# Altium project Assem_Stn_2_Rev1.PrjPcb (part 3 of 3)
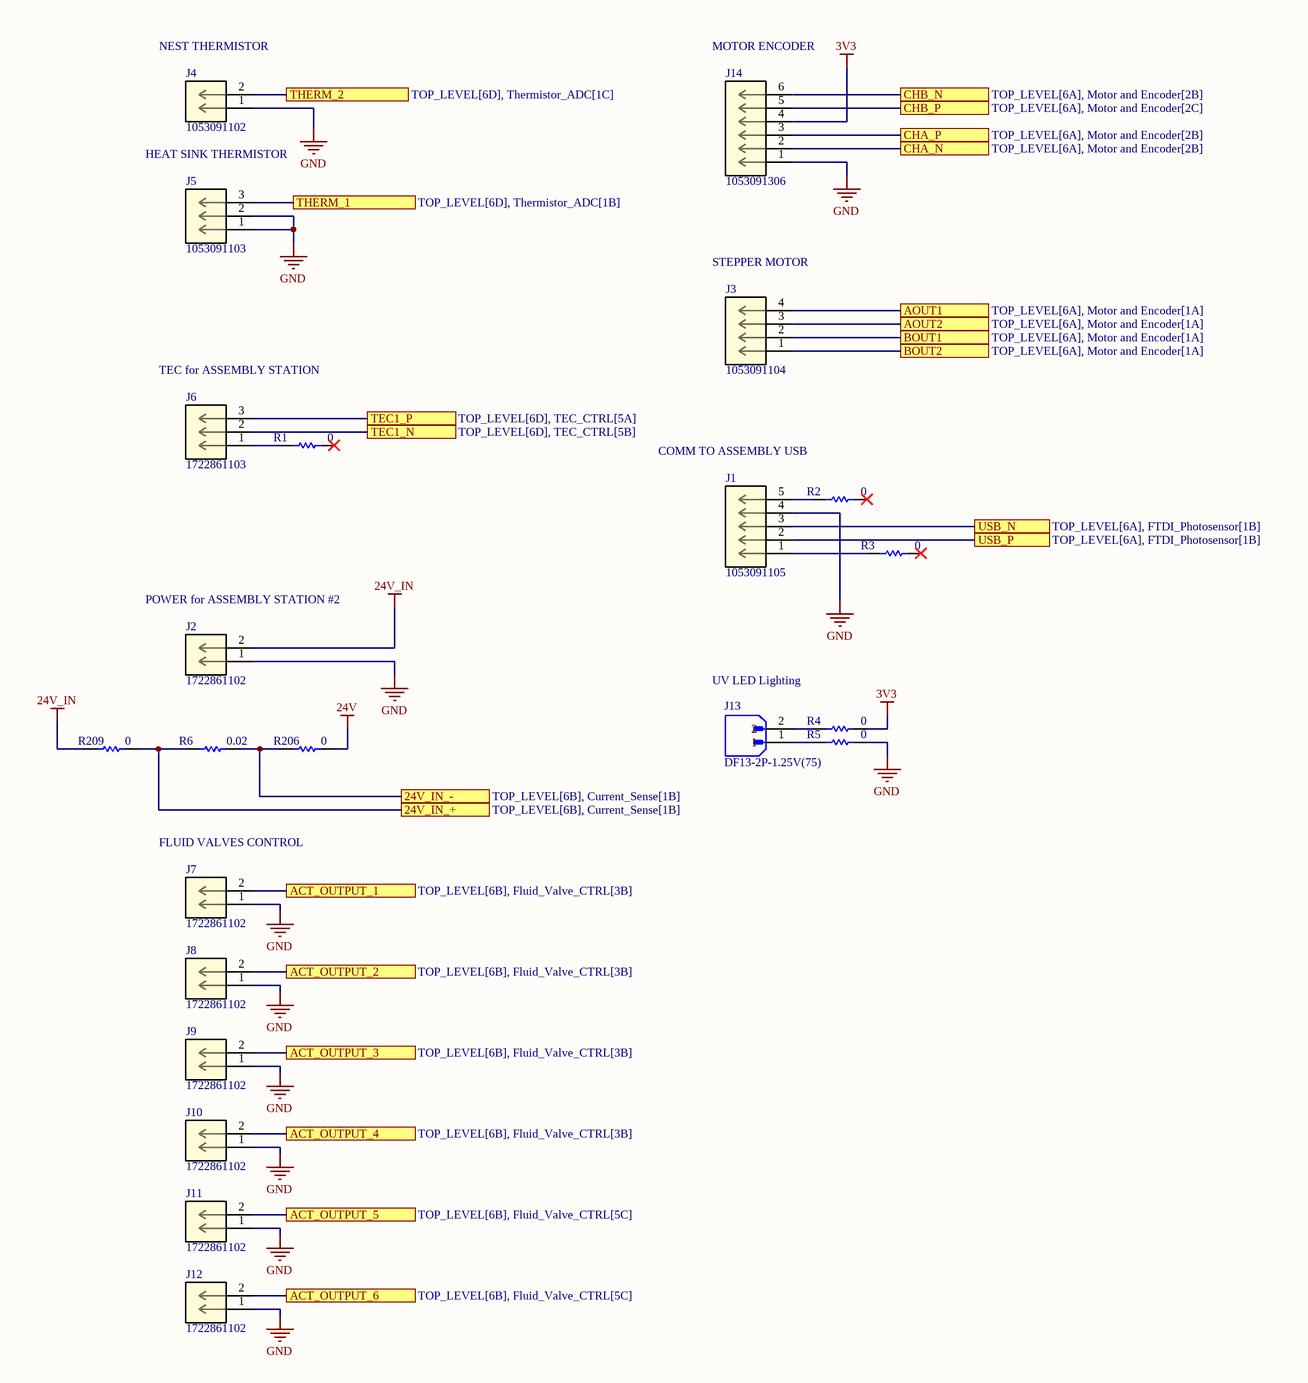
[diagram p11: Connectors.SchDoc]

## Nets that join several sheets
3V3: Motor and Encoder (C9.1 U3.1), Power_LoadSwitches (R49.1 R199.1 TP2.TP), TEC_CTRL (C40.2 C41.2 U7.12), Fluid_Valve_CTRL (6 pins), Thermistor_ADC (C64.2 C76.2 U11.10 U45.10), VREF_DAC (C88.2 U44.16), FTDI_Photosensor (R169.1 U20.1), MicroController (54 pins), Connectors (J14.4 R4.1)
5V: Motor and Encoder (C7.2 C8.2 U2.16 U3.14), Power_LoadSwitches (7 pins), TEC_CTRL (C38.2 C39.2 U7.14), Thermistor_ADC (6 pins), VREF_DAC (C87.2 C89.2 U44.7 U46.1), Current_Sense (12 pins), FTDI_Photosensor (C96.2 C97.2 U19.12)
24V: Power_LoadSwitches (16 pins), Connectors (R206.1)
24V_MOTOR: Motor and Encoder (7 pins), Power_LoadSwitches (5 pins)
24V_TEC: Power_LoadSwitches (5 pins), TEC_CTRL (17 pins)
24V_VALVES: Power_LoadSwitches (5 pins), Fluid_Valve_CTRL (12 pins)
GND: Motor and Encoder (15 pins), Power_LoadSwitches (46 pins), TEC_CTRL (22 pins), Fluid_Valve_CTRL (48 pins), Thermistor_ADC (27 pins), VREF_DAC (9 pins), Current_Sense (18 pins), FTDI_Photosensor (11 pins), MicroController (58 pins), Connectors (13 pins)
3V3_CURR_+: Power_LoadSwitches (5 pins), Current_Sense (R213.2)
3V3_CURR_-: Power_LoadSwitches (R48.1 R199.2), Current_Sense (R212.2)
3V3_CURR_INA181: Thermistor_ADC (R106.2), Current_Sense (U15.1)
5V_CURR_+: Power_LoadSwitches (7 pins), Current_Sense (R211.2)
5V_CURR_-: Power_LoadSwitches (R44.1 R203.2), Current_Sense (R210.2)
5V_CURR_INA181: Thermistor_ADC (R104.2), Current_Sense (U13.1)
24V_IN_+: Current_Sense (R146.2), Connectors (R6.2 R209.1)
24V_IN_-: Current_Sense (R145.2), Connectors (R6.1 R206.2)
24V_MOTOR_CURR_REG: Power_LoadSwitches (R62.1 U5.5), Thermistor_ADC (R116.2)
24V_MOTOR_EN: Power_LoadSwitches (R57.2), MicroController (U21.149)
24V_MTR_CURR+: Power_LoadSwitches (R56.2 U5.1 U5.7), Current_Sense (R217.2)
24V_MTR_CURR-: Power_LoadSwitches (R56.1 R201.2), Current_Sense (R216.2)
24V_TEC_CURR_+: Power_LoadSwitches (R50.2 U33.1 U33.7), Current_Sense (R142.2)
24V_TEC_CURR_-: Power_LoadSwitches (R50.1 R200.2), Current_Sense (R141.2)
24V_TEC_CURR_REG: Power_LoadSwitches (R54.1 U33.5), Thermistor_ADC (R113.2)
24V_TEC_EN: Power_LoadSwitches (R51.2), MicroController (U21.147)
24V_VALVE_EN: Power_LoadSwitches (R59.2), MicroController (U21.148)
24V_VALVES_CURR+: Power_LoadSwitches (R58.2 U6.1 U6.7), Current_Sense (R215.2)
24V_VALVES_CURR-: Power_LoadSwitches (R58.1 R202.2), Current_Sense (R214.2)
24V_VALVES_CURR_REG: Power_LoadSwitches (R66.1 U6.5), Thermistor_ADC (R115.2)
ACT_INPUT_1: Fluid_Valve_CTRL (R89.1 U8.30), MicroController (R180.1)
ACT_INPUT_2: Fluid_Valve_CTRL (R90.1 U8.11), MicroController (R181.1)
ACT_INPUT_3: Fluid_Valve_CTRL (R91.1 U8.15), MicroController (R183.1)
ACT_INPUT_4: Fluid_Valve_CTRL (R92.1 U8.26), MicroController (R186.1)
ACT_INPUT_5: Fluid_Valve_CTRL (R94.1 U9.30), MicroController (R187.1)
ACT_INPUT_6: Fluid_Valve_CTRL (R95.1 U9.11), MicroController (R188.1)
ACT_INPUT_7: Fluid_Valve_CTRL (R96.1 U9.15), MicroController (R189.1)
ACT_INPUT_8: Fluid_Valve_CTRL (R97.1 U9.26), MicroController (R190.1)
ACT_INPUT_EN: Fluid_Valve_CTRL (R86.2 R87.2), MicroController (U21.69)
ACT_OUTPUT_1: Fluid_Valve_CTRL (U8.31), Connectors (J7.2)
ACT_OUTPUT_2: Fluid_Valve_CTRL (U8.10), Connectors (J8.2)
ACT_OUTPUT_3: Fluid_Valve_CTRL (U8.16), Connectors (J9.2)
ACT_OUTPUT_4: Fluid_Valve_CTRL (U8.25), Connectors (J10.2)
ACT_OUTPUT_5: Fluid_Valve_CTRL (U9.31), Connectors (J11.2)
ACT_OUTPUT_6: Fluid_Valve_CTRL (U9.10), Connectors (J12.2)
AOUT1: Motor and Encoder (U1.5), Connectors (J3.4)
AOUT2: Motor and Encoder (U1.7), Connectors (J3.3)
BOUT1: Motor and Encoder (U1.10), Connectors (J3.2)
BOUT2: Motor and Encoder (U1.8), Connectors (J3.1)
CH_A_3V3: Motor and Encoder (R36.2), MicroController (U21.41)
CH_B_3V3: Motor and Encoder (R37.2), MicroController (U21.42)
CHA_N: Motor and Encoder (R20.2 R23.1), Connectors (J14.2)
CHA_P: Motor and Encoder (R21.2 R23.2), Connectors (J14.3)
CHB_N: Motor and Encoder (R32.2 R35.1), Connectors (J14.6)
CHB_P: Motor and Encoder (R30.2 R35.2), Connectors (J14.5)
DECAY: Motor and Encoder (R16.1), MicroController (U21.98)
DIR: Motor and Encoder (U1.20), MicroController (U21.97)
G: Motor and Encoder (R26.2), MicroController (U21.90)
IN1_TEC1: TEC_CTRL (R70.2), MicroController (U21.4)
IN2_TEC1: TEC_CTRL (R71.2), MicroController (U21.5)
LID_CLOSE: FTDI_Photosensor (R170.1), MicroController (U21.150)
LS_OE: Motor and Encoder (R42.1), MicroController (U21.89)
MODE0: Motor and Encoder (U1.24), MicroController (U21.95)
MODE1: Motor and Encoder (U1.25), MicroController (U21.94)
MODE2: Motor and Encoder (U1.26), MicroController (U21.91)
MODE_TEC1: TEC_CTRL (R74.2), MicroController (U21.67)
MTR_CURR_INA181: Thermistor_ADC (R108.2), Current_Sense (U18.1)
nFAULT: Motor and Encoder (R11.2 U1.18), MicroController (U21.170)
nFAULT_TEC1: TEC_CTRL (R81.2), MicroController (U21.68)
nHOME: Motor and Encoder (R7.2 U1.27), MicroController (U21.2)
nRESET: Motor and Encoder (R10.2 U1.16), MicroController (U21.1)
nSLEEP: Motor and Encoder (R9.2 U1.17), MicroController (U21.171)
nSLEEP_TEC1: TEC_CTRL (R72.2), MicroController (U21.3)
RESET_USB: FTDI_Photosensor (C101.2 R159.2 R168.2), MicroController (U21.72)
SO1: TEC_CTRL (R73.1 R75.1), Thermistor_ADC (R117.2)
SPI_CS_ADC1: Thermistor_ADC (R105.2), MicroController (U21.144)
SPI_CS_ADC2: Thermistor_ADC (R122.2), MicroController (U21.145)
SPI_CS_DAC1: VREF_DAC (R133.2), MicroController (U21.143)
SPI_CS_TEC1: TEC_CTRL (R78.2), MicroController (U21.146)
SPI_SCLK: TEC_CTRL (R76.2), Thermistor_ADC (R110.2 R127.2), VREF_DAC (R139.2), MicroController (R179.2 TP8.TP)
SPI_SDI: TEC_CTRL (R77.2), Thermistor_ADC (R109.2 R126.2), VREF_DAC (R135.2), MicroController (R185.2 TP12.TP)
SPI_SDO: TEC_CTRL (R79.2), Thermistor_ADC (R107.2 R124.2), VREF_DAC (R137.2), MicroController (R182.2 TP9.TP)
STEP: Motor and Encoder (U1.22), MicroController (U21.96)
TEC1_N: TEC_CTRL (L3.1), Connectors (J6.2)
TEC1_P: TEC_CTRL (L2.2), Connectors (J6.3)
TEC_CURR_INA181: Thermistor_ADC (R100.2), Current_Sense (U12.1)
THERM_1: Thermistor_ADC (R98.2 R112.2), Connectors (J5.3)
THERM_2: Thermistor_ADC (R99.2 R118.2), Connectors (J4.2)
TOTAL_CURR_24V: Thermistor_ADC (R101.2), Current_Sense (U14.1)
UART_RX: FTDI_Photosensor (J15.2 R155.1), MicroController (U21.128)
UART_TX: FTDI_Photosensor (J15.1 R153.1), MicroController (U21.129)
USB_N: FTDI_Photosensor (C98.2 R154.2), Connectors (J1.3)
USB_P: FTDI_Photosensor (C99.2 R156.2), Connectors (J1.2)
VALVE_CURR_INA181: Thermistor_ADC (R103.2), Current_Sense (U17.1)
VREF_TEC1: TEC_CTRL (U7.15), VREF_DAC (R128.1)